# Altium schematic sheet 08- MCU PORTE_F_G.SchDoc: MCU1
size 420 x 297 mm; Revision: 1.0; SheetNumber: 8; SheetTotal: 13; Project: LOW LEVEL ECU
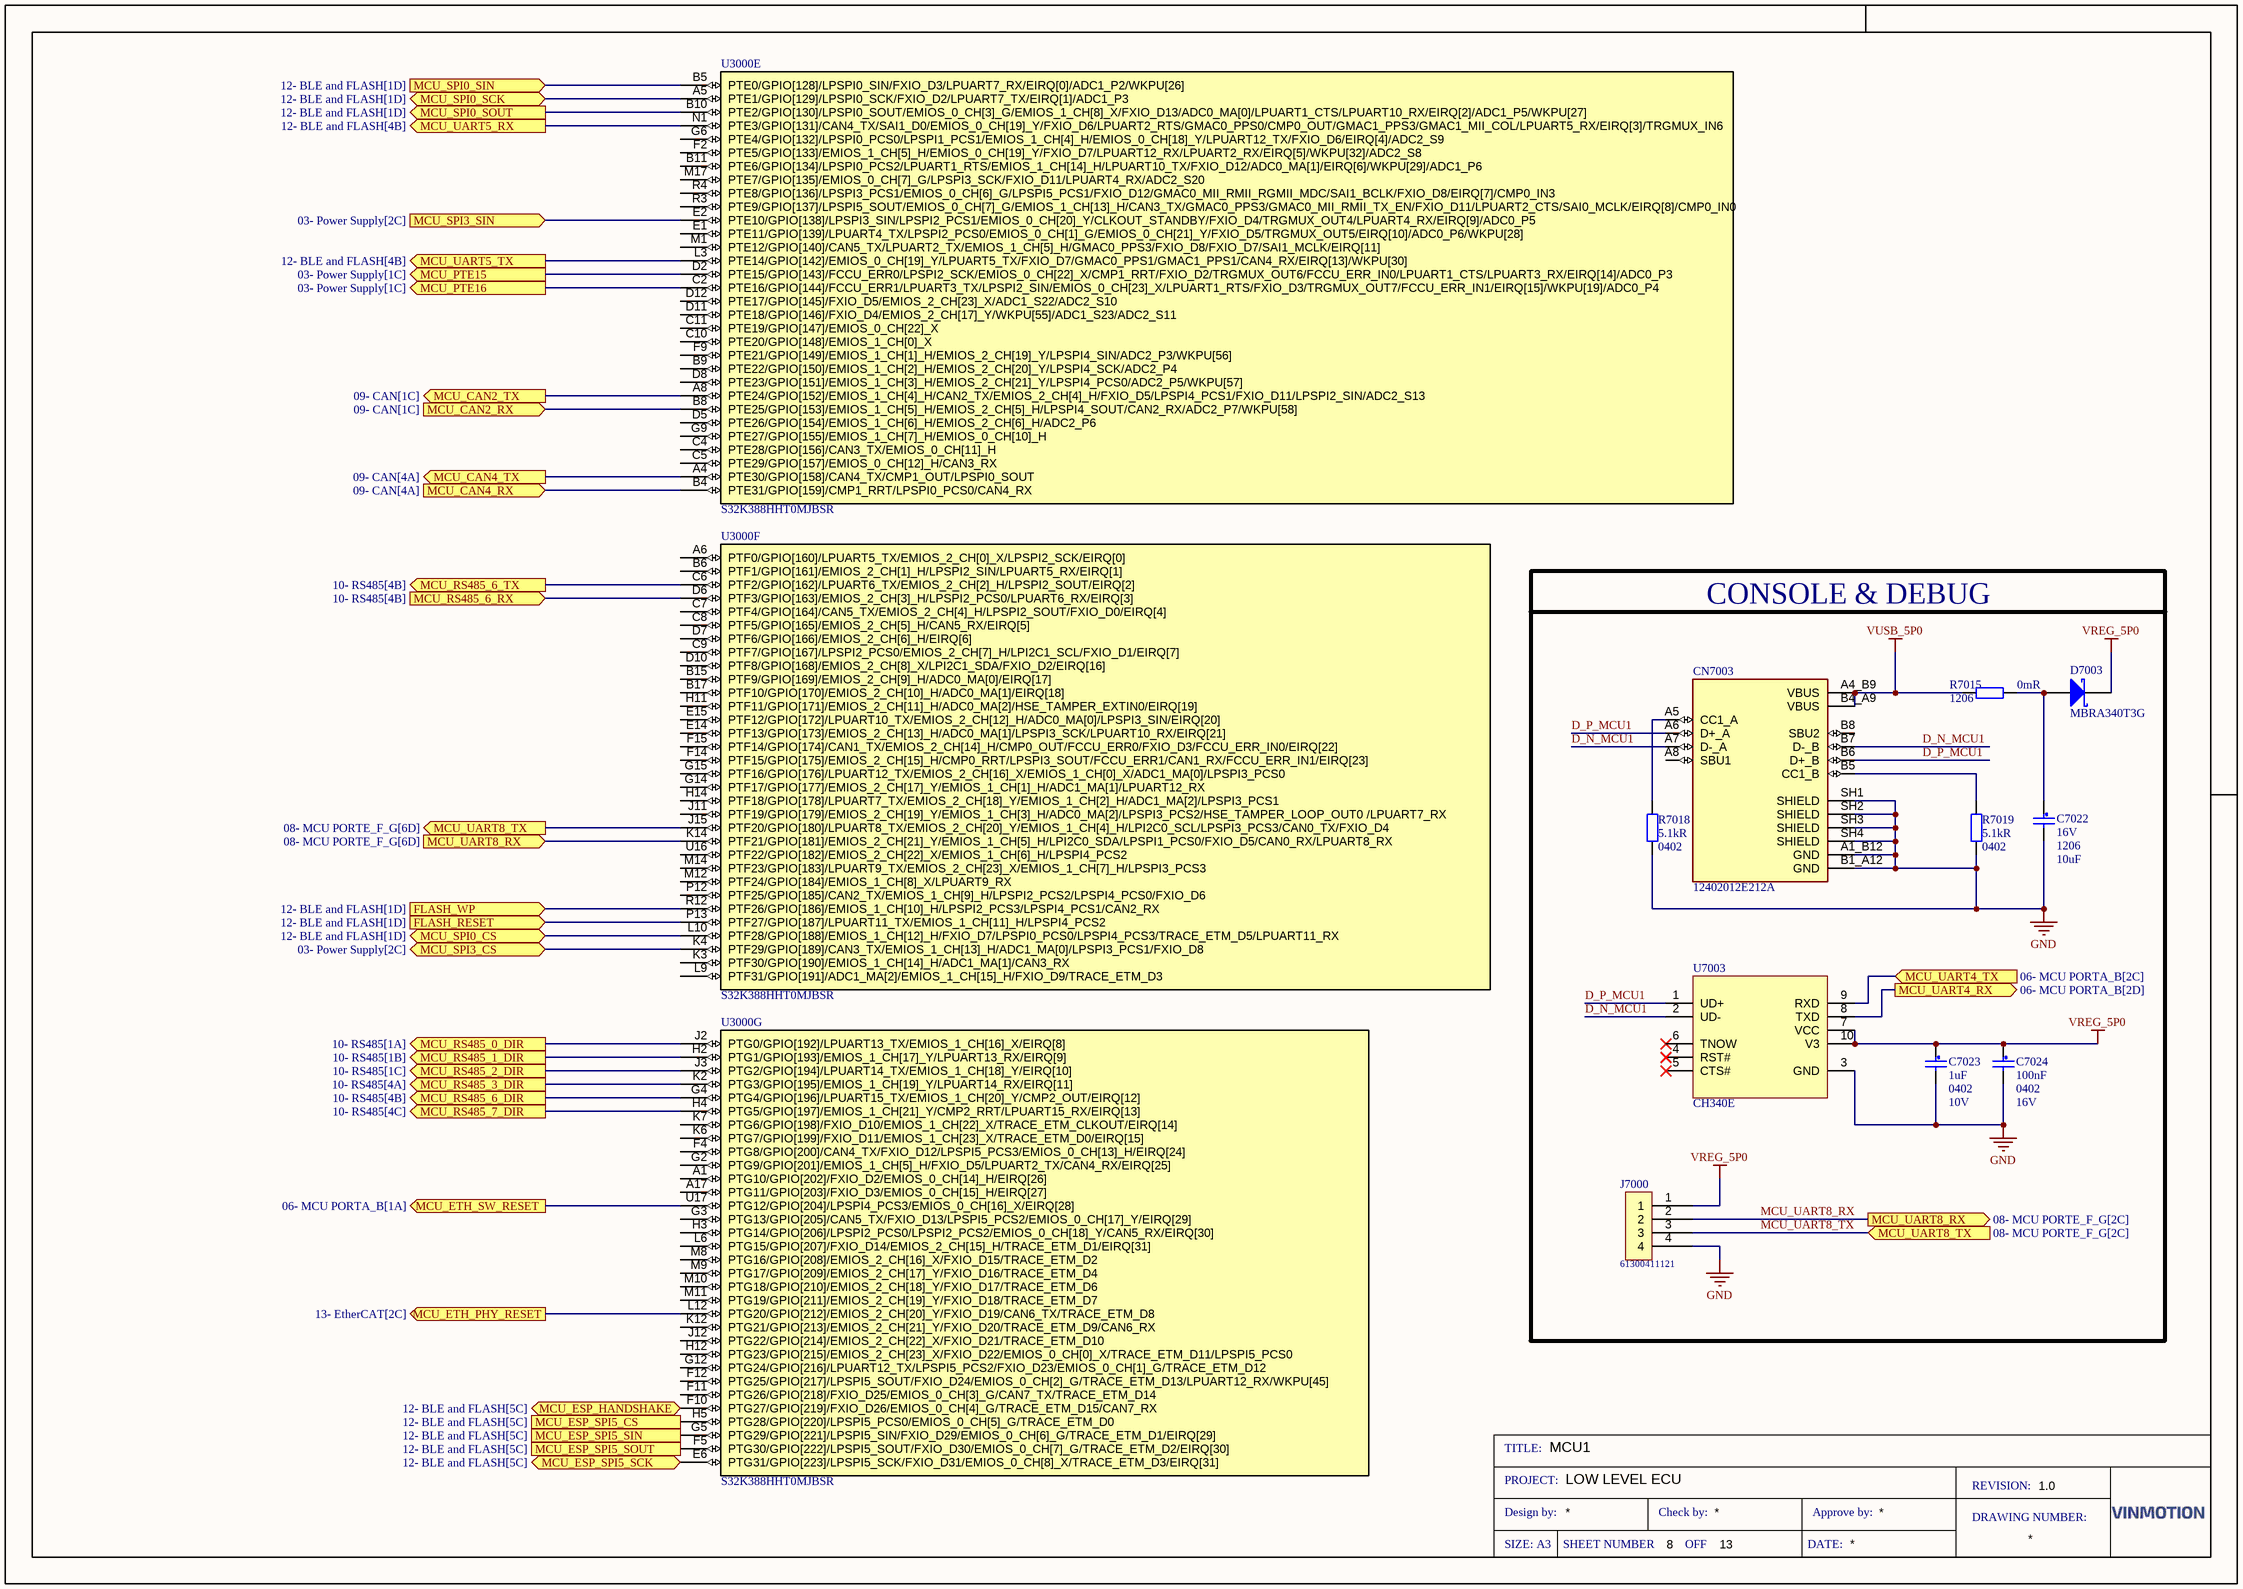
[diagram p0: 08- MCU PORTE_F_G.SchDoc]

## Parts
C7022  Voltage Rating: 16V  Case/Package: 1206  Capacitance: 10uF  [CAP1206]  (hidden comment: CL31B106KOHVPNE)
C7023  value 1uF  Case/Package: 0402  Rated DC Voltage (URdc): 10V  [CAP0402]  (hidden comment: CL05X105KP5NNNC)
C7024  Capacitance: 100nF  Case/Package: 0402  Voltage Rating (DC): 16V  [CAP0402]  (hidden comment: 0402YC104KAT2A)
CN7003  12402012E212A  [USB_TYPE_C]
D7003  MBRA340T3G  [ON_SMA_NRVBA340T3G_N]
J7000  61300411121  [WURTH_61300411121_R]
R7015  Resistance: 0mR  Case/Package: 1206  [RES1206]  (hidden comment: AC1206JR-070RL)
R7018  Resistance: 5.1kR  Case/Package: 0402  [RES0402]  (hidden comment: MCR01MZPF5101)
R7019  Resistance: 5.1kR  Case/Package: 0402  [RES0402]  (hidden comment: MCR01MZPF5101)
U3000  S32K388HHT0MJBSR  [BGA289C80P17X17_1400X1400X152]  (parts E,F,G of 9)
U7003  CH340E  [CH340E]

## Blocks framed on the sheet
CONSOLE & DEBUG: C7022-C7024 CN7003 D7003 J7000 R7015 R7018 R7019 U7003

## Ports
FLASH_RESET (in, see 12- BLE and FLASH[1D]), FLASH_WP (in, see 12- BLE and FLASH[1D]), MCU_CAN2_RX (in, see 09- CAN[1C]), MCU_CAN2_TX (out, see 09- CAN[1C]), MCU_CAN4_RX (in, see 09- CAN[4A]), MCU_CAN4_TX (out, see 09- CAN[4A]), MCU_ESP_HANDSHAKE (bidir, see 12- BLE and FLASH[5C]), MCU_ESP_SPI5_CS (out, see 12- BLE and FLASH[5C]), MCU_ESP_SPI5_SCK (bidir, see 12- BLE and FLASH[5C]), MCU_ESP_SPI5_SIN (in, see 12- BLE and FLASH[5C]), MCU_ESP_SPI5_SOUT (out, see 12- BLE and FLASH[5C]), MCU_ETH_PHY_RESET (out, see 13- EtherCAT[2C]), MCU_ETH_SW_RESET (out, see 06- MCU PORTA_B[1A]), MCU_PTE15 (out, see 03- Power Supply[1C]), MCU_PTE16 (out, see 03- Power Supply[1C]), MCU_RS485_0_DIR (out, see 10- RS485[1A]), MCU_RS485_1_DIR (out, see 10- RS485[1B]), MCU_RS485_2_DIR (out, see 10- RS485[1C]), MCU_RS485_3_DIR (out, see 10- RS485[4A]), MCU_RS485_6_DIR (out, see 10- RS485[4B]), MCU_RS485_6_RX (in, see 10- RS485[4B]), MCU_RS485_6_TX (out, see 10- RS485[4B]), MCU_RS485_7_DIR (out, see 10- RS485[4C]), MCU_SPI0_CS (bidir, see 12- BLE and FLASH[1D]), MCU_SPI0_SCK (bidir, see 12- BLE and FLASH[1D]), MCU_SPI0_SIN (in, see 12- BLE and FLASH[1D]), MCU_SPI0_SOUT (out, see 12- BLE and FLASH[1D]), MCU_SPI3_CS (bidir, see 03- Power Supply[2C]), MCU_SPI3_SIN (in, see 03- Power Supply[2C]), MCU_UART4_RX (out, see 06- MCU PORTA_B[2D]), MCU_UART4_TX (in, see 06- MCU PORTA_B[2C]), MCU_UART5_RX (out, see 12- BLE and FLASH[4B]), MCU_UART5_TX (out, see 12- BLE and FLASH[4B]), MCU_UART8_RX (in, see 08- MCU PORTE_F_G[6D]), MCU_UART8_RX (out, see 08- MCU PORTE_F_G[2C]), MCU_UART8_TX (in, see 08- MCU PORTE_F_G[2C]), MCU_UART8_TX (out, see 08- MCU PORTE_F_G[6D])

## Nets
GND: C7022.2 C7023.2 C7024.2 CN7003.A1_B12(GND) CN7003.B1_A12(GND) CN7003.SH1(SHIELD) CN7003.SH2(SHIELD) CN7003.SH3(SHIELD) CN7003.SH4(SHIELD) J7000.4 R7018.1 R7019.1 U7003.3(GND)
VREG_5P0: C7023.1 C7024.1 D7003.1(K) J7000.1 U7003.7(VCC) U7003.10(V3)
VUSB_5P0: CN7003.A4_B9(VBUS) CN7003.B4_A9(VBUS) R7015.1
D_N_MCU1: CN7003.A7(D-_A) CN7003.B7(D-_B) U7003.2(UD-)
D_P_MCU1: CN7003.A6(D+_A) CN7003.B6(D+_B) U7003.1(UD+)
FLASH_RESET: U3000.P13(PTF27/GPIO[187]/LPUART11_TX/EMIOS_1_CH[11]_H/LPSPI4_PCS2) ; port FLASH_RESET
FLASH_WP: U3000.R12(PTF26/GPIO[186]/EMIOS_1_CH[10]_H/LPSPI2_PCS3/LPSPI4_PCS1/CAN2_RX) ; port FLASH_WP
MCU_CAN2_RX: U3000.B8(PTE25/GPIO[153]/EMIOS_1_CH[5]_H/EMIOS_2_CH[5]_H/LPSPI4_SOUT/CAN2_RX/ADC2_P7/WKPU[58]) ; port MCU_CAN2_RX
MCU_CAN2_TX: U3000.A8(PTE24/GPIO[152]/EMIOS_1_CH[4]_H/CAN2_TX/EMIOS_2_CH[4]_H/FXIO_D5/LPSPI4_PCS1/FXIO_D11/LPSPI2_SIN/ADC2_S13) ; port MCU_CAN2_TX
MCU_CAN4_RX: U3000.B4(PTE31/GPIO[159]/CMP1_RRT/LPSPI0_PCS0/CAN4_RX) ; port MCU_CAN4_RX
MCU_CAN4_TX: U3000.A4(PTE30/GPIO[158]/CAN4_TX/CMP1_OUT/LPSPI0_SOUT) ; port MCU_CAN4_TX
MCU_ESP_HANDSHAKE: U3000.F10(PTG27/GPIO[219]/FXIO_D26/EMIOS_0_CH[4]_G/TRACE_ETM_D15/CAN7_RX) ; port MCU_ESP_HANDSHAKE
MCU_ESP_SPI5_CS: U3000.H5(PTG28/GPIO[220]/LPSPI5_PCS0/EMIOS_0_CH[5]_G/TRACE_ETM_D0) ; port MCU_ESP_SPI5_CS
MCU_ESP_SPI5_SCK: U3000.E6(PTG31/GPIO[223]/LPSPI5_SCK/FXIO_D31/EMIOS_0_CH[8]_X/TRACE_ETM_D3/EIRQ[31]) ; port MCU_ESP_SPI5_SCK
MCU_ESP_SPI5_SIN: U3000.G5(PTG29/GPIO[221]/LPSPI5_SIN/FXIO_D29/EMIOS_0_CH[6]_G/TRACE_ETM_D1/EIRQ[29]) ; port MCU_ESP_SPI5_SIN
MCU_ESP_SPI5_SOUT: U3000.F5(PTG30/GPIO[222]/LPSPI5_SOUT/FXIO_D30/EMIOS_0_CH[7]_G/TRACE_ETM_D2/EIRQ[30]) ; port MCU_ESP_SPI5_SOUT
MCU_ETH_PHY_RESET: U3000.L12(PTG20/GPIO[212]/EMIOS_2_CH[20]_Y/FXIO_D19/CAN6_TX/TRACE_ETM_D8) ; port MCU_ETH_PHY_RESET
MCU_ETH_SW_RESET: U3000.U17(PTG12/GPIO[204]/LPSPI4_PCS3/EMIOS_0_CH[16]_X/EIRQ[28]) ; port MCU_ETH_SW_RESET
MCU_PTE15: U3000.D2(PTE15/GPIO[143]/FCCU_ERR0/LPSPI2_SCK/EMIOS_0_CH[22]_X/CMP1_RRT/FXIO_D2/TRGMUX_OUT6/FCCU_ERR_IN0/LPUART1_CTS/LPUART3_RX/EIRQ[14]/ADC0_P3) ; port MCU_PTE15
MCU_PTE16: U3000.C2(PTE16/GPIO[144]/FCCU_ERR1/LPUART3_TX/LPSPI2_SIN/EMIOS_0_CH[23]_X/LPUART1_RTS/FXIO_D3/TRGMUX_OUT7/FCCU_ERR_IN1/EIRQ[15]/WKPU[19]/ADC0_P4) ; port MCU_PTE16
MCU_RS485_0_DIR: U3000.J2(PTG0/GPIO[192]/LPUART13_TX/EMIOS_1_CH[16]_X/EIRQ[8]) ; port MCU_RS485_0_DIR
MCU_RS485_1_DIR: U3000.H2(PTG1/GPIO[193]/EMIOS_1_CH[17]_Y/LPUART13_RX/EIRQ[9]) ; port MCU_RS485_1_DIR
MCU_RS485_2_DIR: U3000.J3(PTG2/GPIO[194]/LPUART14_TX/EMIOS_1_CH[18]_Y/EIRQ[10]) ; port MCU_RS485_2_DIR
MCU_RS485_3_DIR: U3000.K2(PTG3/GPIO[195]/EMIOS_1_CH[19]_Y/LPUART14_RX/EIRQ[11]) ; port MCU_RS485_3_DIR
MCU_RS485_6_DIR: U3000.G4(PTG4/GPIO[196]/LPUART15_TX/EMIOS_1_CH[20]_Y/CMP2_OUT/EIRQ[12]) ; port MCU_RS485_6_DIR
MCU_RS485_6_RX: U3000.D6(PTF3/GPIO[163]/EMIOS_2_CH[3]_H/LPSPI2_PCS0/LPUART6_RX/EIRQ[3]) ; port MCU_RS485_6_RX
MCU_RS485_6_TX: U3000.C6(PTF2/GPIO[162]/LPUART6_TX/EMIOS_2_CH[2]_H/LPSPI2_SOUT/EIRQ[2]) ; port MCU_RS485_6_TX
MCU_RS485_7_DIR: U3000.H4(PTG5/GPIO[197]/EMIOS_1_CH[21]_Y/CMP2_RRT/LPUART15_RX/EIRQ[13]) ; port MCU_RS485_7_DIR
MCU_SPI0_CS: U3000.L10(PTF28/GPIO[188]/EMIOS_1_CH[12]_H/FXIO_D7/LPSPI0_PCS0/LPSPI4_PCS3/TRACE_ETM_D5/LPUART11_RX) ; port MCU_SPI0_CS
MCU_SPI0_SCK: U3000.A5(PTE1/GPIO[129]/LPSPI0_SCK/FXIO_D2/LPUART7_TX/EIRQ[1]/ADC1_P3) ; port MCU_SPI0_SCK
MCU_SPI0_SIN: U3000.B5(PTE0/GPIO[128]/LPSPI0_SIN/FXIO_D3/LPUART7_RX/EIRQ[0]/ADC1_P2/WKPU[26]) ; port MCU_SPI0_SIN
MCU_SPI0_SOUT: U3000.B10(PTE2/GPIO[130]/LPSPI0_SOUT/EMIOS_0_CH[3]_G/EMIOS_1_CH[8]_X/FXIO_D13/ADC0_MA[0]/LPUART1_CTS/LPUART10_RX/EIRQ[2]/ADC1_P5/WKPU[27]) ; port MCU_SPI0_SOUT
MCU_SPI3_CS: U3000.K4(PTF29/GPIO[189]/CAN3_TX/EMIOS_1_CH[13]_H/ADC1_MA[0]/LPSPI3_PCS1/FXIO_D8) ; port MCU_SPI3_CS
MCU_SPI3_SIN: U3000.E2(PTE10/GPIO[138]/LPSPI3_SIN/LPSPI2_PCS1/EMIOS_0_CH[20]_Y/CLKOUT_STANDBY/FXIO_D4/TRGMUX_OUT4/LPUART4_RX/EIRQ[9]/ADC0_P5) ; port MCU_SPI3_SIN
MCU_UART4_RX: U7003.8(TXD) ; port MCU_UART4_RX
MCU_UART4_TX: U7003.9(RXD) ; port MCU_UART4_TX
MCU_UART5_RX: U3000.N1(PTE3/GPIO[131]/CAN4_TX/SAI1_D0/EMIOS_0_CH[19]_Y/FXIO_D6/LPUART2_RTS/GMAC0_PPS0/CMP0_OUT/GMAC1_PPS3/GMAC1_MII_COL/LPUART5_RX/EIRQ[3]/TRGMUX_IN6) ; port MCU_UART5_RX
MCU_UART5_TX: U3000.L3(PTE14/GPIO[142]/EMIOS_0_CH[19]_Y/LPUART5_TX/FXIO_D7/GMAC0_PPS1/GMAC1_PPS1/CAN4_RX/EIRQ[13]/WKPU[30]) ; port MCU_UART5_TX
MCU_UART8_RX: J7000.2 U3000.K14(PTF21/GPIO[181]/EMIOS_2_CH[21]_Y/EMIOS_1_CH[5]_H/LPI2C0_SDA/LPSPI1_PCS0/FXIO_D5/CAN0_RX/LPUART8_RX) ; port MCU_UART8_RX
MCU_UART8_TX: J7000.3 U3000.J15(PTF20/GPIO[180]/LPUART8_TX/EMIOS_2_CH[20]_Y/EMIOS_1_CH[4]_H/LPI2C0_SCL/LPSPI3_PCS3/CAN0_TX/FXIO_D4) ; port MCU_UART8_TX
NetC7022_1: C7022.1 D7003.2(A) R7015.2
NetCN7003_A5: CN7003.A5(CC1_A) R7018.2
NetCN7003_B5: CN7003.B5(CC1_B) R7019.2

Not connected (* = marked no-connect by the designer): CN7003 A8(SBU1) B8(SBU2); U3000 A1(PTG10/GPIO[202]/FXIO_D2/EMIOS_0_CH[14]_H/EIRQ[26]) A6(PTF0/GPIO[160]/LPUART5_TX/EMIOS_2_CH[0]_X/LPSPI2_SCK/EIRQ[0]) A17(PTG11/GPIO[203]/FXIO_D3/EMIOS_0_CH[15]_H/EIRQ[27]) B6(PTF1/GPIO[161]/EMIOS_2_CH[1]_H/LPSPI2_SIN/LPUART5_RX/EIRQ[1]) B9(PTE22/GPIO[150]/EMIOS_1_CH[2]_H/EMIOS_2_CH[20]_Y/LPSPI4_SCK/ADC2_P4) B11(PTE6/GPIO[134]/LPSPI0_PCS2/LPUART1_RTS/EMIOS_1_CH[14]_H/LPUART10_TX/FXIO_D12/ADC0_MA[1]/EIRQ[6]/WKPU[29]/ADC1_P6) B15(PTF9/GPIO[169]/EMIOS_2_CH[9]_H/ADC0_MA[0]/EIRQ[17]) B17(PTF10/GPIO[170]/EMIOS_2_CH[10]_H/ADC0_MA[1]/EIRQ[18]) C4(PTE28/GPIO[156]/CAN3_TX/EMIOS_0_CH[11]_H) C5(PTE29/GPIO[157]/EMIOS_0_CH[12]_H/CAN3_RX) C7(PTF4/GPIO[164]/CAN5_TX/EMIOS_2_CH[4]_H/LPSPI2_SOUT/FXIO_D0/EIRQ[4]) C8(PTF5/GPIO[165]/EMIOS_2_CH[5]_H/CAN5_RX/EIRQ[5]) C9(PTF7/GPIO[167]/LPSPI2_PCS0/EMIOS_2_CH[7]_H/LPI2C1_SCL/FXIO_D1/EIRQ[7]) C10(PTE20/GPIO[148]/EMIOS_1_CH[0]_X) C11(PTE19/GPIO[147]/EMIOS_0_CH[22]_X) D5(PTE26/GPIO[154]/EMIOS_1_CH[6]_H/EMIOS_2_CH[6]_H/ADC2_P6) D7(PTF6/GPIO[166]/EMIOS_2_CH[6]_H/EIRQ[6]) D8(PTE23/GPIO[151]/EMIOS_1_CH[3]_H/EMIOS_2_CH[21]_Y/LPSPI4_PCS0/ADC2_P5/WKPU[57]) D10(PTF8/GPIO[168]/EMIOS_2_CH[8]_X/LPI2C1_SDA/FXIO_D2/EIRQ[16]) D11(PTE18/GPIO[146]/FXIO_D4/EMIOS_2_CH[17]_Y/WKPU[55]/ADC1_S23/ADC2_S11) D12(PTE17/GPIO[145]/FXIO_D5/EMIOS_2_CH[23]_X/ADC1_S22/ADC2_S10) E1(PTE11/GPIO[139]/LPUART4_TX/LPSPI2_PCS0/EMIOS_0_CH[1]_G/EMIOS_0_CH[21]_Y/FXIO_D5/TRGMUX_OUT5/EIRQ[10]/ADC0_P6/WKPU[28]) E14(PTF13/GPIO[173]/EMIOS_2_CH[13]_H/ADC0_MA[1]/LPSPI3_SCK/LPUART10_RX/EIRQ[21]) E15(PTF12/GPIO[172]/LPUART10_TX/EMIOS_2_CH[12]_H/ADC0_MA[0]/LPSPI3_SIN/EIRQ[20]) F2(PTE5/GPIO[133]/EMIOS_1_CH[5]_H/EMIOS_0_CH[19]_Y/FXIO_D7/LPUART12_RX/LPUART2_RX/EIRQ[5]/WKPU[32]/ADC2_S8) F4(PTG8/GPIO[200]/CAN4_TX/FXIO_D12/LPSPI5_PCS3/EMIOS_0_CH[13]_H/EIRQ[24]) F9(PTE21/GPIO[149]/EMIOS_1_CH[1]_H/EMIOS_2_CH[19]_Y/LPSPI4_SIN/ADC2_P3/WKPU[56]) F11(PTG26/GPIO[218]/FXIO_D25/EMIOS_0_CH[3]_G/CAN7_TX/TRACE_ETM_D14) F12(PTG25/GPIO[217]/LPSPI5_SOUT/FXIO_D24/EMIOS_0_CH[2]_G/TRACE_ETM_D13/LPUART12_RX/WKPU[45]) F14(PTF15/GPIO[175]/EMIOS_2_CH[15]_H/CMP0_RRT/LPSPI3_SOUT/FCCU_ERR1/CAN1_RX/FCCU_ERR_IN1/EIRQ[23]) F15(PTF14/GPIO[174]/CAN1_TX/EMIOS_2_CH[14]_H/CMP0_OUT/FCCU_ERR0/FXIO_D3/FCCU_ERR_IN0/EIRQ[22]) G2(PTG9/GPIO[201]/EMIOS_1_CH[5]_H/FXIO_D5/LPUART2_TX/CAN4_RX/EIRQ[25]) G3(PTG13/GPIO[205]/CAN5_TX/FXIO_D13/LPSPI5_PCS2/EMIOS_0_CH[17]_Y/EIRQ[29]) G6(PTE4/GPIO[132]/LPSPI0_PCS0/LPSPI1_PCS1/EMIOS_1_CH[4]_H/EMIOS_0_CH[18]_Y/LPUART12_TX/FXIO_D6/EIRQ[4]/ADC2_S9) G9(PTE27/GPIO[155]/EMIOS_1_CH[7]_H/EMIOS_0_CH[10]_H) G12(PTG24/GPIO[216]/LPUART12_TX/LPSPI5_PCS2/FXIO_D23/EMIOS_0_CH[1]_G/TRACE_ETM_D12) G14(PTF17/GPIO[177]/EMIOS_2_CH[17]_Y/EMIOS_1_CH[1]_H/ADC1_MA[1]/LPUART12_RX) G15(PTF16/GPIO[176]/LPUART12_TX/EMIOS_2_CH[16]_X/EMIOS_1_CH[0]_X/ADC1_MA[0]/LPSPI3_PCS0) H3(PTG14/GPIO[206]/LPSPI2_PCS0/LPSPI2_PCS2/EMIOS_0_CH[18]_Y/CAN5_RX/EIRQ[30]) H11(PTF11/GPIO[171]/EMIOS_2_CH[11]_H/ADC0_MA[2]/HSE_TAMPER_EXTIN0/EIRQ[19]) H12(PTG23/GPIO[215]/EMIOS_2_CH[23]_X/FXIO_D22/EMIOS_0_CH[0]_X/TRACE_ETM_D11/LPSPI5_PCS0) H14(PTF18/GPIO[178]/LPUART7_TX/EMIOS_2_CH[18]_Y/EMIOS_1_CH[2]_H/ADC1_MA[2]/LPSPI3_PCS1) J11(PTF19/GPIO[179]/EMIOS_2_CH[19]_Y/EMIOS_1_CH[3]_H/ADC0_MA[2]/LPSPI3_PCS2/HSE_TAMPER_LOOP_OUT0_/LPUART7_RX) J12(PTG22/GPIO[214]/EMIOS_2_CH[22]_X/FXIO_D21/TRACE_ETM_D10) K3(PTF30/GPIO[190]/EMIOS_1_CH[14]_H/ADC1_MA[1]/CAN3_RX) K6(PTG7/GPIO[199]/FXIO_D11/EMIOS_1_CH[23]_X/TRACE_ETM_D0/EIRQ[15]) K7(PTG6/GPIO[198]/FXIO_D10/EMIOS_1_CH[22]_X/TRACE_ETM_CLKOUT/EIRQ[14]) K12(PTG21/GPIO[213]/EMIOS_2_CH[21]_Y/FXIO_D20/TRACE_ETM_D9/CAN6_RX) L6(PTG15/GPIO[207]/FXIO_D14/EMIOS_2_CH[15]_H/TRACE_ETM_D1/EIRQ[31]) L9(PTF31/GPIO[191]/ADC1_MA[2]/EMIOS_1_CH[15]_H/FXIO_D9/TRACE_ETM_D3) M1(PTE12/GPIO[140]/CAN5_TX/LPUART2_TX/EMIOS_1_CH[5]_H/GMAC0_PPS3/FXIO_D8/FXIO_D7/SAI1_MCLK/EIRQ[11]) M8(PTG16/GPIO[208]/EMIOS_2_CH[16]_X/FXIO_D15/TRACE_ETM_D2) M9(PTG17/GPIO[209]/EMIOS_2_CH[17]_Y/FXIO_D16/TRACE_ETM_D4) M10(PTG18/GPIO[210]/EMIOS_2_CH[18]_Y/FXIO_D17/TRACE_ETM_D6) M11(PTG19/GPIO[211]/EMIOS_2_CH[19]_Y/FXIO_D18/TRACE_ETM_D7) M12(PTF24/GPIO[184]/EMIOS_1_CH[8]_X/LPUART9_RX) M14(PTF23/GPIO[183]/LPUART9_TX/EMIOS_2_CH[23]_X/EMIOS_1_CH[7]_H/LPSPI3_PCS3) M17(PTE7/GPIO[135]/EMIOS_0_CH[7]_G/LPSPI3_SCK/FXIO_D11/LPUART4_RX/ADC2_S20) P12(PTF25/GPIO[185]/CAN2_TX/EMIOS_1_CH[9]_H/LPSPI2_PCS2/LPSPI4_PCS0/FXIO_D6) R3(PTE9/GPIO[137]/LPSPI5_SOUT/EMIOS_0_CH[7]_G/EMIOS_1_CH[13]_H/CAN3_TX/GMAC0_PPS3/GMAC0_MII_RMII_TX_EN/FXIO_D11/LPUART2_CTS/SAI0_MCLK/EIRQ[8]/CMP0_IN0) R4(PTE8/GPIO[136]/LPSPI3_PCS1/EMIOS_0_CH[6]_G/LPSPI5_PCS1/FXIO_D12/GMAC0_MII_RMII_RGMII_MDC/SAI1_BCLK/FXIO_D8/EIRQ[7]/CMP0_IN3) U16(PTF22/GPIO[182]/EMIOS_2_CH[22]_X/EMIOS_1_CH[6]_H/LPSPI4_PCS2); U7003 4(RST#)* 5(CTS#)* 6(TNOW)*

## Notes on the sheet
- TITLE:
- PROJECT:
- Design by:
- Check by:
- Approve by:
- DRAWING NUMBER:
- REVISION:
- SIZE: A3
- SHEET NUMBER
- OFF
- DATE:

## Library data of the parts
C7022 = CMP-00045-5: CAP CER 10uF 16V 10% X7R 1206 SMD; Manufacturer 1: Samsung; Crossable(YES/NO): YES; Ratings: AEC-Q200; Packaging: Tape and Reel; Thickness: 0.071inch; Min Operating Temperature: -55°C; Case Code (Metric): 3216; Max Operating Temperature: 125°C; Mount: Surface Mount; Length: 0.126inch; Dielectric: X7R; Tolerance: 10%; Width: 0.063inch; Case Code (Imperial): 1206; Manufacturer Part Number 1: CL31B106KOHVPNE; Features: Soft Termination; Mount Type(SMD/TH): SMD; Height: 1.6mm; Lead Free: Lead Free; Voltage Rating (DC): 16V
C7023 = CMP-01106-1: CAP CER 1UF 10V X6S 0402; Manufacturer: Samsung; Capacitor Type: Ceramic; Multilayer: Yes; Tolerance  (fill in as +-): 10%; Max Operating Temperature: 105°C; Category: Ceramic Capacitors; Dielectric Material: Ceramic; Height: 0.55mm; JESD-609 Code: e3; Length: 1mm; Manufacturer Part Number: CL05X105KP5NNNC; Min Operating Temperature: -55°C; Mounting Technology: Surface Mount; Pins: 2; Package Shape: Rectangular; Package Style: SMTMeter; Packaging: Tape and Reel; Tolerance (fill in as +-): 10%; Reach SVHC Compliant: Yes; RoHS Compliant: Yes; Temperature Characteristics Code: X6S; Terminal Finish: Nickel; Termination: Wraparound; Width: 0.5mm
C7024 = CMP-00988-1: CAP CER 0.1UF 16V X7R 0402; Manufacturer 1: KYOCERA AVX; Crossable(YES/NO): YES; Mount Type(SMD/TH): SMD; Case Code (Imperial): 0402; Case Code (Metric): 1005; Dielectric: X7R; Manufacturer Part Number 1: 0402YC104KAT2A; Max Operating Temperature: 125°C; Min Operating Temperature: -55°C; Mount: Surface Mount; Voltage Rating: 16V
CN7003 = CMP-01116-1: CONN RCP USB2.0 TYP C 24P SMD RA; Manufacturer: Amphenol; Manufacturer Part Number: 12402012E212A; Category: Connectors
D7003 = CMP-00015-4: DIODE SCHOTTKY 40V 3A SMA; Manufacturer: onsemi; Additional Feature: FREE WHEELING DIODE; Application(s): POWER; Diode Element Material: SILICON; Diode Type: RECTIFIER; Forward Voltage: 390mV; Non-rep Pk Forward Current-Max: 100A; Number of Elements: 1; Package Body Material: Plastic; Qualification Status: Not Qualified; Time @ Peak Reflow Temperature-Max (s): 40s; ComponentLink1URL: https://datasheet.ciiva.com/30479/0900766b812212c7-30479618.pdf?src-supplier=RSComponents; ComponentLink1Description: https://datasheet.ciiva.com/30479/0900766b812212c7-30479618.pdf?src-supplier=RSComponents; ComponentLink2URL: https://datasheet.ciiva.com/923/mbra340t3-d-923224.pdf?src-supplier=Digi-Key; ComponentLink2Description: https://datasheet.ciiva.com/923/mbra340t3-d-923224.pdf?src-supplier=Digi-Key; ComponentLink3URL: https://datasheet.ciiva.com/8294/mbra340t3-d-8294077.pdf?src-supplier=Avnet; ComponentLink3Description: https://datasheet.ciiva.com/8294/mbra340t3-d-8294077.pdf?src-supplier=Avnet; Category: Schottky Diodes; JESD-30 Code: R-PDSO-C2; JESD-609 Code: e3; Manufacturer Part Number: MBRA340T3G; Max Operating Temperature: 150°C; Max Output current: 3A; Min Operating Temperature: -55°C; Moisture Sensitivity Level: 1; Number of Phases: 1; Pins: 2; Package Shape: Rectangular; Package Style: SMALL OUTLINEMeter; Peak Reflow Temperature (Cel): 260°C; Reach SVHC Compliant: No; Rep Pk Reverse Voltage-Max: 40V; RoHS Compliant: Yes; Surface Mount: Yes; Technology: SCHOTTKY; Terminal Finish: Tin; Terminal Form: C BEND; Terminal Position: DUAL
J7000 = CMP-00025-12: CONN HEADER VERT 4POS 2.54MM; Manufacturer 1: Wurth Electronics; Number of Positions: 4; Mount Type(SMD/TH): TH; Gender: Male; Pitch: 0.1inch; Connector Type: Male Pin; Crossable(YES/NO): YES; Contact Material: Copper; Manufacturer Part Number 1: 61300411121; Contact Plating: Gold; Contact Mating Length: 0.236inch; REACH SVHC: Unknown; Operating Temperature: -40°C ~ 105°C; Mount: Through Hole; Number of Contacts: 4; Lead Free: Lead Free; Packaging: Bulk; Number of Rows: 1; Termination: Solder; Color: Black; Max Operating Temperature: 105°C; Min Operating Temperature: -40°C
R7015 = CMP-00083-6: RES 0R 1/4W 5% 1206 SMD; Manufacturer 1: Yageo; Max Power Dissipation: 250mW; Crossable(YES/NO): YES; Temperature Coefficient: 200ppm/°C; Voltage Rating: 200V; Length: 0.122inch; Features: Moisture Resistant,Automotive AEC-Q200; Tolerance: 5%; Package Quantity: 5000; Height: 0.026inch; Min Operating Temperature: -55°C; Mount Type(SMD/TH): SMD; Case Code (Imperial): 1206; Composition: Thick Film; Number of Terminations: 2; Termination: SMD/SMT; Packaging: Tape and Reel; Power Rating: 250mW; Width: 0.063inch; Manufacturer Part Number 1: AC1206JR-070RL; Max Operating Temperature: 155°C; Lead Free: Lead Free; Case Code (Metric): 3216
R7018 R7019 = CMP-00289-1: RES SMD 5.1K OHM 1% 1/16W 0402; Manufacturer 1: Rohm Semiconductor; Crossable(YES/NO): YES; Max Power Dissipation: 63mW; Voltage Rating (DC): 50V; Temperature Coefficient: 400ppm/°C; Width: 0.02inch; Number of Terminations: 2; Min Operating Temperature: -55°C; Mount Type(SMD/TH): SMD; Case Code (Metric): 1005; Depth: 0.5mm; Max Operating Temperature: 155°C; Composition: Thick Film; Features: Automotive AEC-Q200; Height: 0.016inch; Packaging: Tape and Reel; Package Quantity: 10000; Length: 0.039inch; Tolerance: 1%; Lead Free: Lead Free; Case Code (Imperial): 0402; Manufacturer Part Number 1: MCR01MZPF5101; Military Standard: Not
U3000 = CMP-01150-1: ARM® Cortex®-M7F S32K3 Microcontroller IC 32-Bit 5-Core 320MHz 8MB (8M x 8) FLASH 289-LFBGA (14x14); Manufacturer: NXP Semiconductors; Category: Microcontrollers; Manufacturer Part Number: S32K388HHT0MJBSR
U7003 = CMP-01117-1: USB TO UART IC